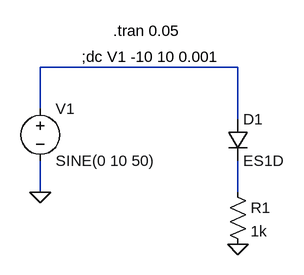
[diagram p0: schematic task_2.asc]
task_2.asc, the LTspice schematic file:
Version 4
SHEET 1 880 680
WIRE 224 80 -80 80
WIRE -80 144 -80 80
WIRE 224 160 224 80
WIRE -80 272 -80 224
WIRE 224 272 224 224
FLAG -80 272 0
FLAG 224 352 0
SYMBOL diode 208 160 R0
SYMATTR InstName D1
SYMATTR Value ES1D
SYMBOL voltage -80 128 R0
WINDOW 123 0 0 Left 0
WINDOW 39 0 0 Left 0
SYMATTR InstName V1
SYMATTR Value SINE(0 10 50)
SYMBOL res 208 256 R0
SYMATTR InstName R1
SYMATTR Value 1k
TEXT -16 64 Left 2 !;dc V1 -10 10 0.001
TEXT 32 24 Left 2 !.tran 0.05

The netlist it stands for:
* task_2.asc
D1 N001 N002 ES1D
V1 N001 0 SINE(0 10 50)
R1 N002 0 1k
.model D D
.lib standard.dio
;dc V1 -10 10 0.001
.tran 0.05
.backanno
.end